# Altium schematic sheet Processamento.SchDoc
size A; SheetNumber: 1; SheetTotal: 1
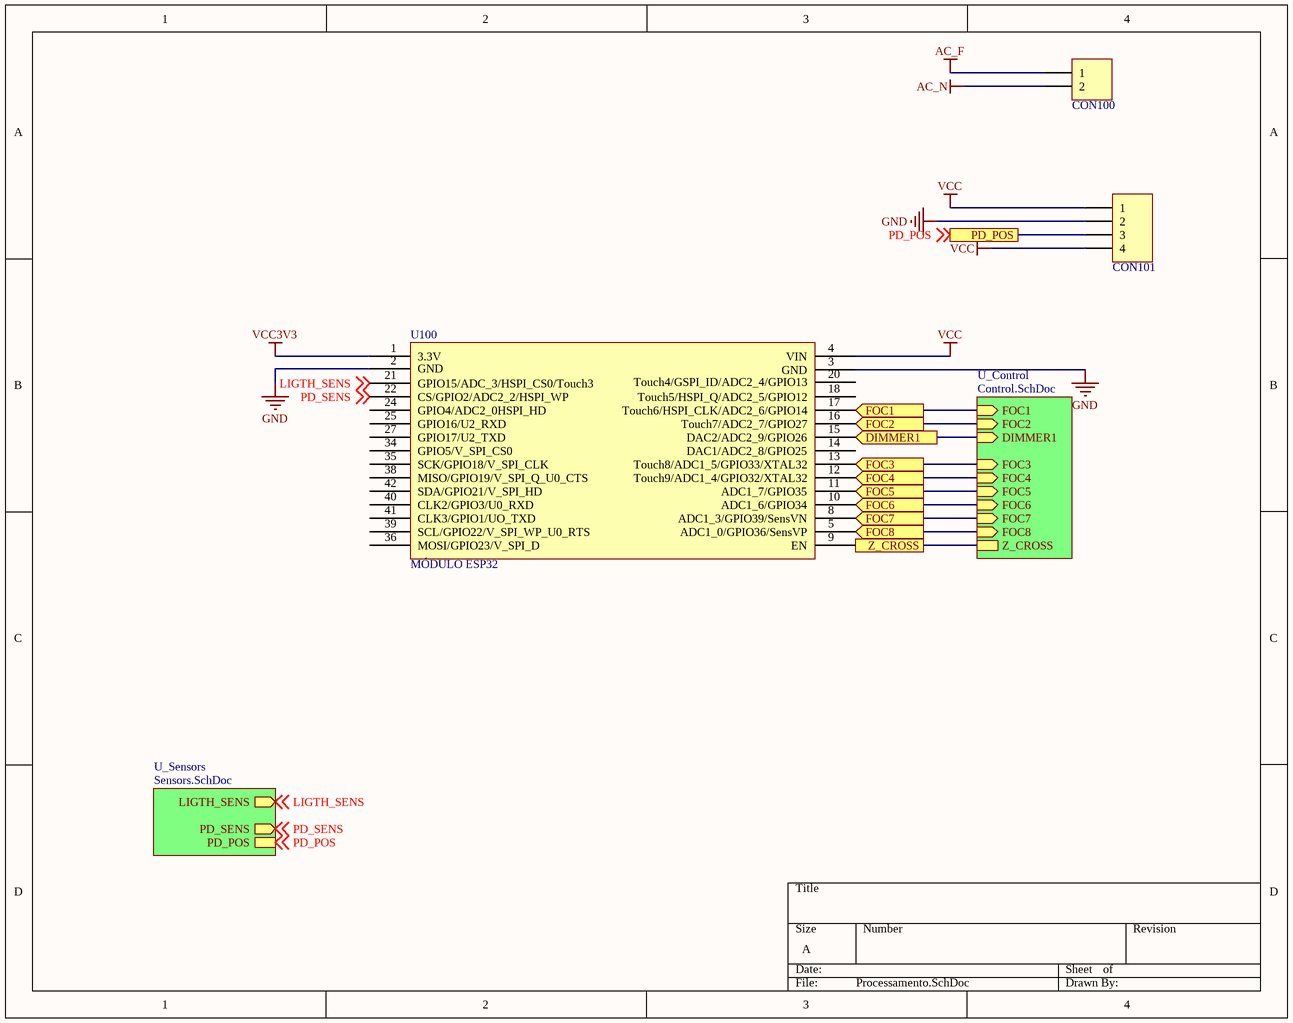
[diagram p0: Processamento.SchDoc]

## Parts
CON100  TERM BLOCK 2POS  [MSTBA 2G]  (value not drawn)
CON101  TERM BLOCK 4POS  [MSTBA 4G]  (value not drawn)
U100  MÓDULO ESP32  [ESP32 MOD]

## Sub-sheets
U_Control = Control.SchDoc: FOC8 (in), FOC7 (in), FOC6 (in), FOC5 (in), FOC4 (in), FOC3 (in), FOC2 (in), FOC1 (in), DIMMER1 (in), Z_CROSS
U_Sensors = Sensors.SchDoc: PD_POS, LIGTH_SENS (out), PD_SENS (out)

## Ports
DIMMER1 (out), FOC1 (out), FOC2 (out), FOC3 (out), FOC4 (out), FOC5 (out), FOC6 (out), FOC7 (out), FOC8 (out), PD_POS, Z_CROSS

## Nets
AC_F: CON100.1
AC_N: CON100.2
GND: CON101.2 U100.2(GND) U100.3(GND)
VCC: CON101.1 CON101.4 U100.4(VIN)
VCC3V3: U100.1(3.3V)
DIMMER1: U100.15(DAC2/ADC2_9/GPIO26) ; port DIMMER1, sheet U_Control/DIMMER1
FOC1: U100.17(Touch6/HSPI_CLK/ADC2_6/GPIO14) ; port FOC1, sheet U_Control/FOC1
FOC2: U100.16(Touch7/ADC2_7/GPIO27) ; port FOC2, sheet U_Control/FOC2
FOC3: U100.13(Touch8/ADC1_5/GPIO33/XTAL32) ; port FOC3, sheet U_Control/FOC3
FOC4: U100.12(Touch9/ADC1_4/GPIO32/XTAL32) ; port FOC4, sheet U_Control/FOC4
FOC5: U100.11(ADC1_7/GPIO35) ; port FOC5, sheet U_Control/FOC5
FOC6: U100.10(ADC1_6/GPIO34) ; port FOC6, sheet U_Control/FOC6
FOC7: U100.8(ADC1_3/GPIO39/SensVN) ; port FOC7, sheet U_Control/FOC7
FOC8: U100.5(ADC1_0/GPIO36/SensVP) ; port FOC8, sheet U_Control/FOC8
LIGTH_SENS: U100.21(GPIO15/ADC_3/HSPI_CS0/Touch3) ; off-sheet LIGTH_SENS, sheet U_Sensors/LIGTH_SENS
PD_POS: CON101.3 ; off-sheet PD_POS, port PD_POS, sheet U_Sensors/PD_POS
PD_SENS: U100.22(CS/GPIO2/ADC2_2/HSPI_WP) ; off-sheet PD_SENS, sheet U_Sensors/PD_SENS
Z_CROSS: U100.9(EN) ; port Z_CROSS, sheet U_Control/Z_CROSS

Not connected (* = marked no-connect by the designer): U100 14(DAC1/ADC2_8/GPIO25) 18(Touch5/HSPI_Q/ADC2_5/GPIO12) 20(Touch4/GSPI_ID/ADC2_4/GPIO13) 24(GPIO4/ADC2_0HSPI_HD) 25(GPIO16/U2_RXD) 27(GPIO17/U2_TXD) 34(GPIO5/V_SPI_CS0) 35(SCK/GPIO18/V_SPI_CLK) 36(MOSI/GPIO23/V_SPI_D) 38(MISO/GPIO19/V_SPI_Q_U0_CTS) 39(SCL/GPIO22/V_SPI_WP_U0_RTS) 40(CLK2/GPIO3/U0_RXD) 41(CLK3/GPIO1/UO_TXD) 42(SDA/GPIO21/V_SPI_HD)

## Library data of the parts
CON100 = TERM BLOCK HEADER 2POS R/A 5.08MM: TERM BLOCK HDR 2POS R/A 5.08MM; Manufacturer: Phoenix Contact; Manufacturer Part Number: 1757242; Number of Positions: 2; Number of Levels: 1; Pitch: 0.200" (5.08mm); Header Orientation: 90°, Right Angle; Current - IEC: 12A; Voltage - IEC: 400V; Current - UL: 15A; Voltage - UL: 300V; Supplier 1: Digi-Key; RoHS: RoHS Compliant; Category: Connectors, Interconnects; Stock 1: 14081; Pricing 1: 1=0.59, 10=0.563, 50=0.5386, 100=0.5239, 250=0.4896, 500=0.45044, 1000=0.408, 2500=0.3888, 5000=0.3648 (USD); Packaging: Bulk; Part Status: Active; Type: Header, Male Pins, Shrouded (4 Side); Positions Per Level: 2; Plug Wire Entry: -; Termination Style: Solder; Mounting Type: Through Hole; Wire Gauge or Range - AWG: -; Wire Gauge or Range - mm²: -; Color: Green; Operating Temperature: -; Contact Mating Finish: Tin; Features: -; ComponentLink1URL: http://media.digikey.com/pdf/Data%20Sheets/Phoenix%20Contact%20PDFs/1757242.pdf; ComponentLink1Description: http://media.digikey.com/pdf/Data%20Sheets/Phoenix%20Contact%20PDFs/1757242.pdf; Supplier Part Number 1: 277-1106-ND; Supplier 2: LCSC; Supplier Part Number 2: C505824
CON101 = TERM BLOCK HEADER 4POS R/A 5.08MM: TERM BLOCK HDR 4POS R/A 5.08MM; ComponentLink1URL: http://media.digikey.com/pdf/Data%20Sheets/Phoenix%20Contact%20PDFs/1757242.pdf; ComponentLink1Description: http://media.digikey.com/pdf/Data%20Sheets/Phoenix%20Contact%20PDFs/1757242.pdf
U100 = IC MICOCONTROLADOR ESP32 MODULO